# Altium schematic sheet 0.SchDoc
size A4
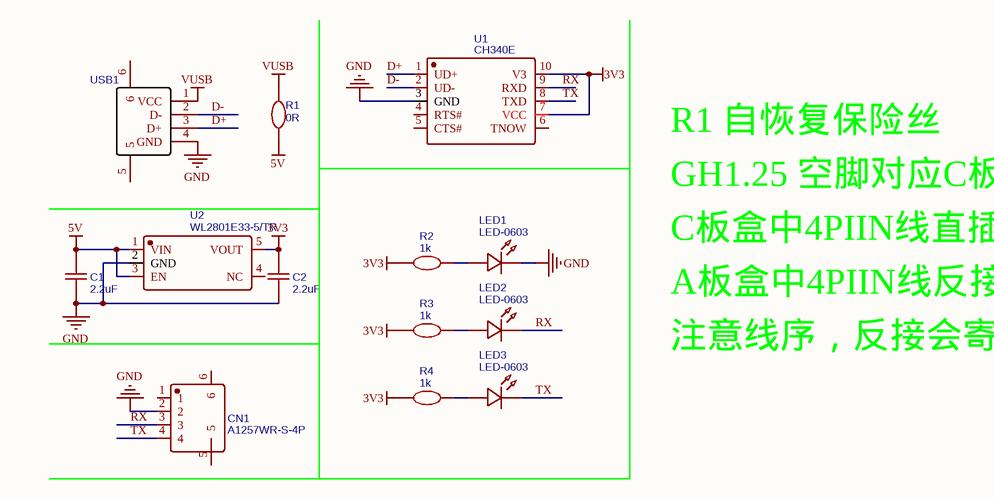
[diagram p0: 0.SchDoc]

## Parts
C1  2.2uF  [C0603]
C2  2.2uF  [C0603]
CN1  A1257WR-S-4P  [CONN-SMD_A1257WR-S-4P]
LED1  LED-0603  [LED0603_RED]
LED2  LED-0603  [LED0603_RED]
LED3  LED-0603  [LED0603_RED]
R1  0R  [R0603]
R2  1k  [R0603]
R3  1k  [R0603]
R4  1k  [R0603]
U1  CH340E  [MSOP-10_L3.0-W3.0-P0.50-LS5.0-BL]
U2  WL2801E33-5/TR  [SOT-23-5_L3.0-W1.7-P0.95-LS2.8-BR]
USB1  (no value)  [USB-TH_U-G-04WS-W-04]

## Nets
3V3: C2.1 R2.1 R3.1 R4.1 U1.7(VCC) U1.10(V3) U2.5(VOUT)
5V: C1.1 R1.2 U2.1(VIN) U2.3(EN)
GND: C1.2 C2.2 CN1.2 LED1.2 U1.3(GND) U2.2(GND) USB1.4(GND)
VUSB: R1.1 USB1.1(VCC)
D+: U1.1(UD+) USB1.3(D+)
D-: U1.2(UD-) USB1.2(D-)
RX: CN1.3 LED2.2 U1.9(RXD)
TX: CN1.4 LED3.2 U1.8(TXD)
NetLED1_1: LED1.1 R2.2
NetLED2_1: LED2.1 R3.2
NetLED3_1: LED3.1 R4.2

Not connected (* = marked no-connect by the designer): CN1 1 5 6; U1 4(RTS#) 5(CTS#) 6(TNOW); U2 4(NC); USB1 5 6

## Notes on the sheet
- R1 自恢复保险丝
- GH1.25 空脚对应C板5V
- C板盒中4PIIN线直插
- A板盒中4PIIN线反接
- 注意线序，反接会寄

## Library data of the parts
C1 C2 = 0.1u: nameAlias: Value(F); Contributor: LCEDA_Lib; spicePre: C; spiceSymbolName: C_0603_US
CN1 = A1257WR-S-4P: BOM_Manufacturer: Changjiang Connectors; Contributor: LCSC; BOM_Supplier: LCSC; BOM_Supplier Part: C225127; BOM_Manufacturer Part: A1257WR-S-4P; spicePre: C; spiceSymbolName: A1257WR-S-4P
LED1-LED3 = LED-0603_R: BOM_Manufacturer: EVERLIGHT(台湾亿光); BOM_Manufacturer Part: 19-217/R6C-AL1M2VY/3T; Contributor: LCEDA_01; BOM_Supplier Part: C72044; BOM_Supplier: LCSC; spicePre: L; spiceSymbolName: LED-0603_R
R1-R4 = 1k: nameAlias: Value(Ω); Contributor: LCEDA_Lib; spicePre: R; spiceSymbolName: R_0603_EU
U1 = CH340E: BOM_Manufacturer: WCH; BOM_Paste Type: recommend; BOM_Supplier: LCSC; BOM_Manufacturer Part: CH340E; BOM_Supplier Part: C99652; spicePre: U; spiceSymbolName: CH340E
U2 = WL2801E33-5/TR: BOM_Manufacturer: WEIER; Contributor: LCSC; BOM_Paste Type: expand; BOM_Supplier: LCSC; BOM_Manufacturer Part: WL2801E33-5/TR; BOM_Supplier Part: C167141; spicePre: U; spiceSymbolName: WL2801E33-5/TR
USB1 = U-G-04WS-W-04: BOM_Manufacturer: Korean Hroparts Elec; Contributor: LCSC; BOM_Supplier: LCSC; BOM_Supplier Part: C879725; BOM_Manufacturer Part: U-G-04WS-W-04; spicePre: U; spiceSymbolName: U-G-04WS-W-04